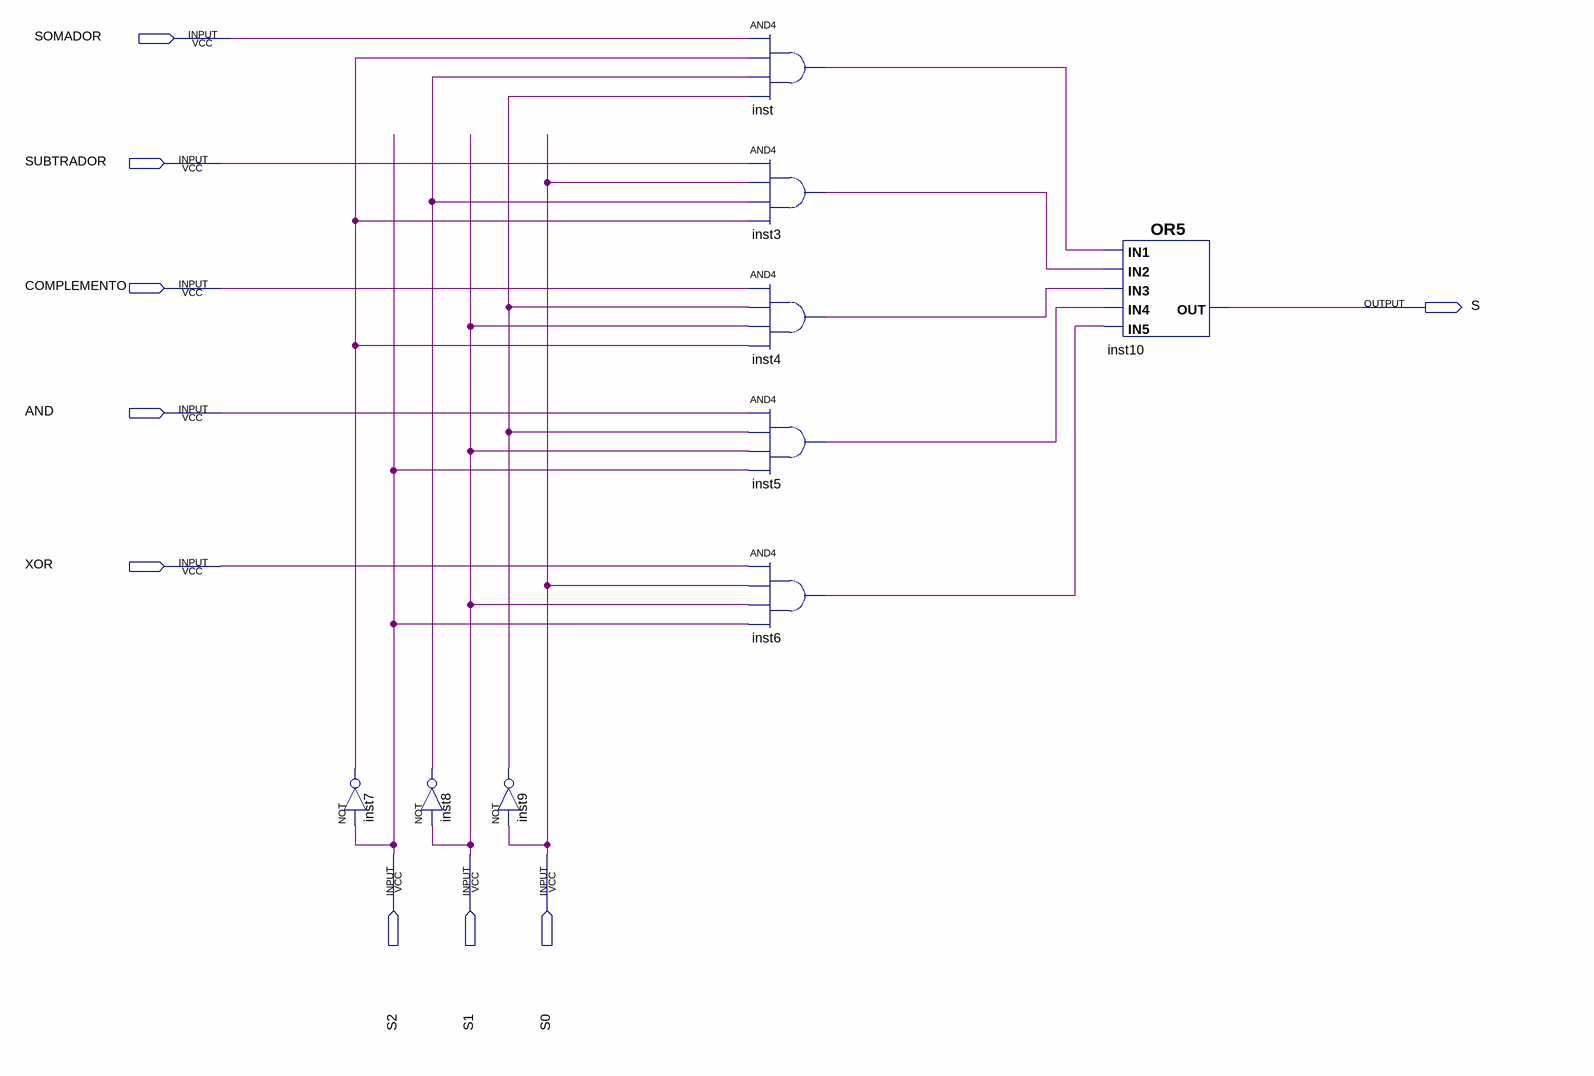
[diagram p0: schematic sheet]
// Quartus schematic MUX.bdf as structural Verilog: 9 symbols, 9 pins
module MUX (
  input  SOMADOR,
  input  SUBTRADOR,
  input  COMPLEMENTO,
  input  AND,
  input  XOR,
  input  S2,
  input  S1,
  input  S0,
  output S
);

  wire inst3_out, inst4_out, inst5_out, inst6_out, inst7_out, inst8_out, inst9_out, inst_out;

  not inst7 (inst7_out, S2);
  not inst8 (inst8_out, S1);
  not inst9 (inst9_out, S0);
  and inst (inst_out, SOMADOR, inst7_out, inst8_out, inst9_out);
  and inst3 (inst3_out, SUBTRADOR, S0, inst8_out, inst7_out);
  and inst4 (inst4_out, COMPLEMENTO, inst9_out, S1, inst7_out);
  and inst5 (inst5_out, AND, inst9_out, S1, S2);
  and inst6 (inst6_out, XOR, S0, S1, S2);
  or inst10 (S, inst_out, inst3_out, inst4_out, inst5_out, inst6_out);
endmodule
